# EAGLE design capbot (EAGLE 7.5.0)
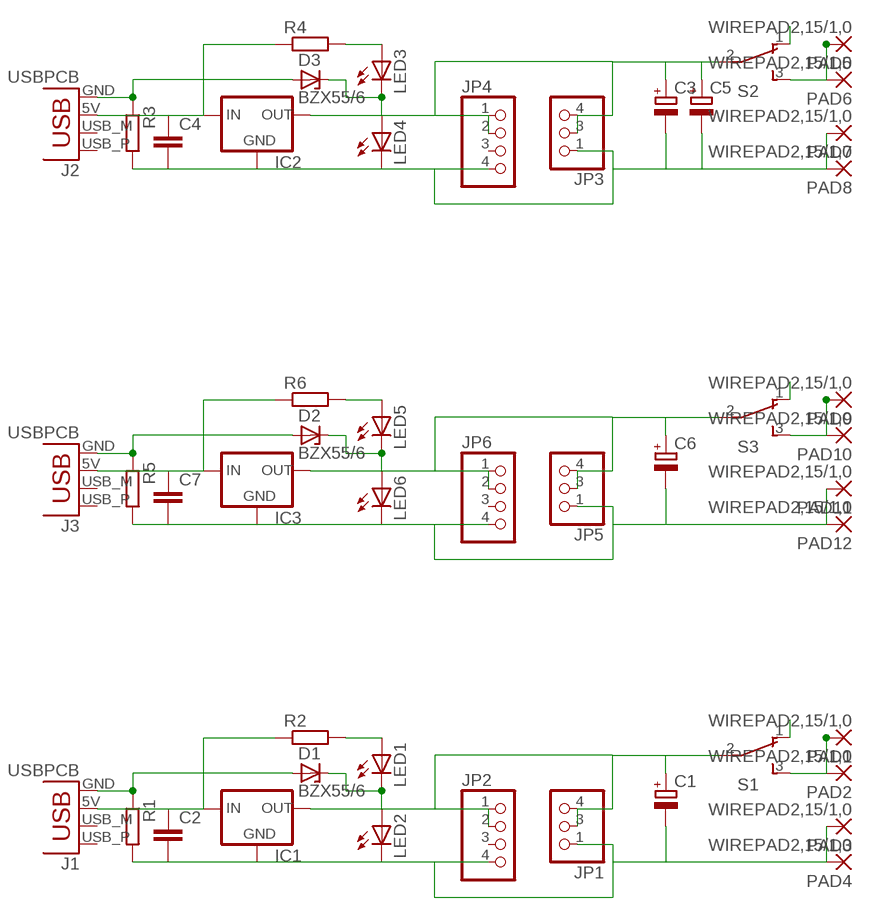
[diagram p0: schematic, sheet 1]

## Parts
C1  CPOL-EUE5-10.5  [E5-10,5]
C2  C-EUC1206  [C1206]
C3  CPOL-EUE5-10.5  [E5-10,5]
C4  C-EUC1206  [C1206]
C5  CPOL-EUE5-10.5  [E5-10,5]
C6  CPOL-EUE5-10.5  [E5-10,5]
C7  C-EUC1206  [C1206]
D1  BZX55/6  [DO35Z6]
D2  BZX55/6  [DO35Z6]
D3  BZX55/6  [DO35Z6]
IC1  MCP1700INLINE  [TO92-INLINE]
IC2  MCP1700INLINE  [TO92-INLINE]
IC3  MCP1700INLINE  [TO92-INLINE]
J1  USBPCB  [USB-A-PCB]
J2  USBPCB  [USB-A-PCB]
J3  USBPCB  [USB-A-PCB]
JP1  PINHD-1X3-4GAP  [1X04/GAP2]
JP2  PINHD-1X4  [1X04/OFFSETDOWN]
JP3  PINHD-1X3-4GAP  [1X04/GAP2]
JP4  PINHD-1X4  [1X04/OFFSETDOWN]
JP5  PINHD-1X3-4GAP  [1X04/GAP2]
JP6  PINHD-1X4  [1X04/OFFSETDOWN]
LED1  LED3MM-MOREFLAT  [LED3MM-MOREFLAT]
LED2  LED3MM-MOREFLAT  [LED3MM-MOREFLAT]
LED3  LED3MM-MOREFLAT  [LED3MM-MOREFLAT]
LED4  LED3MM-MOREFLAT  [LED3MM-MOREFLAT]
LED5  LED3MM-MOREFLAT  [LED3MM-MOREFLAT]
LED6  LED3MM-MOREFLAT  [LED3MM-MOREFLAT]
PAD1  WIREPAD2,15/1,0  [2,15/1,0]
PAD2  WIREPAD2,15/1,0  [2,15/1,0]
PAD3  WIREPAD2,15/1,0  [2,15/1,0]
PAD4  WIREPAD2,15/1,0  [2,15/1,0]
PAD5  WIREPAD2,15/1,0  [2,15/1,0]
PAD6  WIREPAD2,15/1,0  [2,15/1,0]
PAD7  WIREPAD2,15/1,0  [2,15/1,0]
PAD8  WIREPAD2,15/1,0  [2,15/1,0]
PAD9  WIREPAD2,15/1,0  [2,15/1,0]
PAD10  WIREPAD2,15/1,0  [2,15/1,0]
PAD11  WIREPAD2,15/1,0  [2,15/1,0]
PAD12  WIREPAD2,15/1,0  [2,15/1,0]
R1  R-EU_0207/7  [0207/7]
R2  R-EU_0207/7  [0207/7]
R3  R-EU_0207/7  [0207/7]
R4  R-EU_0207/7  [0207/7]
R5  R-EU_0207/7  [0207/7]
R6  R-EU_0207/7  [0207/7]
S1  TL36PO  [TL3XPO]
S2  TL36PO  [TL3XPO]
S3  TL36PO  [TL3XPO]

## Nets
N$1: C1.- C2.2 IC1.1(GND) JP1.1 JP2.4 LED2.K(C) PAD3.1(P) PAD4.1(P) R1.2
N$2: C1.+ IC1.3(OUT) JP1.3 JP1.4 JP2.1 JP2.2 S1.2(P)
N$3: PAD1.1(P) PAD2.1(P) S1.3(S)
N$4: D1.A J1.GND R1.1
N$6: C2.1 IC1.2(IN) J1.5V(VBUS) R2.1
N$8: LED1.A R2.2
N$9: D1.C LED1.K(C) LED2.A
N$10: S1.1(O)
N$11: C3.- C4.2 C5.- IC2.1(GND) JP3.1 JP4.4 LED4.K(C) PAD7.1(P) PAD8.1(P) R3.2
N$12: C3.+ C5.+ IC2.3(OUT) JP3.3 JP3.4 JP4.1 JP4.2 S2.2(P)
N$13: PAD5.1(P) PAD6.1(P) S2.3(S)
N$14: D3.A J2.GND R3.1
N$16: C4.1 IC2.2(IN) J2.5V(VBUS) R4.1
N$18: LED3.A R4.2
N$19: D3.C LED3.K(C) LED4.A
N$20: S2.1(O)
N$21: C6.- C7.2 IC3.1(GND) JP5.1 JP6.4 LED6.K(C) PAD11.1(P) PAD12.1(P) R5.2
N$22: C6.+ IC3.3(OUT) JP5.3 JP5.4 JP6.1 JP6.2 S3.2(P)
N$23: PAD9.1(P) PAD10.1(P) S3.3(S)
N$24: D2.A J3.GND R5.1
N$26: C7.1 IC3.2(IN) J3.5V(VBUS) R6.1
N$28: LED5.A R6.2
N$29: D2.C LED5.K(C) LED6.A
N$30: S3.1(O)
Unconnected: J1.USB_M(D-) J1.USB_P(D+) J2.USB_M(D-) J2.USB_P(D+) J3.USB_M(D-) J3.USB_P(D+) JP2.3 JP4.3 JP6.3

## Library data of the parts
C1 C3 C5 C6 = resistor:CPOL-EU: POLARIZED CAPACITOR, European symbol
C2 C4 C7 = resistor:C-EU: CAPACITOR, European symbol
D1-D3 = cwpackage:BZX55: Z DIODE
IC1-IC3 = adafruit:MCP1700: VOLTAGE REGULATOR
J1-J3 = SparkFun-Connectors:USB: USB Connectors USB-B-PTH is fully proven SKU : PRT-00139/CONN-08278 USB-miniB is fully proven SKU : PRT-00587 USB-A-PCB is untested. USB-A-H is throughly reviewed, but untested. Spark Fun Electronics SKU : PRT-00437 USB-B-SMT is throughly reviewed, but untested. Needs silkscreen touching up. USB-A-S has not been used/tested USB-MB-H has not been used/tested USB-MICROB has been used. CONN-09505
JP1 JP3 JP5 = cwpinhead:PINHD-1X3-4GAP: PIN HEADER
JP2 JP4 JP6 = cwpinhead:PINHD-1X4: PIN HEADER
LED1-LED6 = cwpackage:LED: LED OSRAM: - CHIPLED LG R971, LG N971, LY N971, LG Q971, LY Q971, LO R971, LY R971 LH N974, LH R974 LS Q976, LO Q976, LY Q976 LO Q996 - Hyper CHIPLED LW Q18S LB Q993, LB Q99A, LB R99A - SideLED LS A670, LO A670, LY A670, LG A670, LP A670 LB A673, LV A673, LT A673, LW A673 LH A674 LY A675 LS A676, LA A676, LO A676, LY A676, LW A676 LS A679, LY A679, LG A679 - Hyper Micro SIDELED® LS Y876, LA Y876, LO Y876, LY Y876 LT Y87S - SmartLED LW L88C, LW L88S LB L89C, LB L89S, LG L890 LS L89K, LO L89K, LY L89K LS L896, LA L896, LO L896, LY L896 - TOPLED LS T670, LO T670, LY T670, LG T670, LP T670 LSG T670, LSP T670, LSY T670, LOP T670, LYG T670 LG T671, LOG T671, LSG T671 LB T673, LV T673, LT T673, LW T673 LH T674 LS T676, LA T676, LO T676, LY T676, LB T676, LH T676, LSB T676, LW T676 LB T67C, LV T67C, LT T67C, LS T67K, LO T67K, LY T67K, LW E67C LS E67B, LA E67B, LO E67B, LY E67B, LB E67C, LV E67C, LT E67C LW T67C LS T679, LY T679, LG T679 LS T770, LO T770, LY T770, LG T770, LP T770 LB T773, LV T773, LT T773, LW T773 LH T774 LS E675, LA E675, LY E675, LS T675 LS T776, LA T776, LO T776, LY T776, LB T776 LHGB T686 LT T68C, LB T68C - Hyper Mini TOPLED® LB M676 - Mini TOPLED Santana® LG M470 LS M47K, LO M47K, LY M47K Source: http://www.osram.convergy.de LUXEON: - LUMILED® LXK2-PW12-R00, LXK2-PW12-S00, LXK2-PW14-U00, LXK2-PW14-V00 LXK2-PM12-R00, LXK2-PM12-S00, LXK2-PM14-U00 LXK2-PE12-Q00, LXK2-PE12-R00, LXK2-PE12-S00, LXK2-PE14-T00, LXK2-PE14-U00 LXK2-PB12-K00, LXK2-PB12-L00, LXK2-PB12-M00, LXK2-PB14-N00, LXK2-PB14-P00, LXK2-PB14-Q00 LXK2-PR12-L00, LXK2-PR12-M00, LXK2-PR14-Q00, LXK2-PR14-R00 LXK2-PD12-Q00, LXK2-PD12-R00, LXK2-PD12-S00 LXK2-PH12-R00, LXK2-PH12-S00 LXK2-PL12-P00, LXK2-PL12-Q00, LXK2-PL12-R00 Source: www.luxeon.com KINGBRIGHT: KA-3528ASYC Source: www.kingbright.com
PAD1-PAD12 = wirepad:WIREPAD: Wire PAD connect wire on PCB
R1-R6 = resistor:R-EU_: RESISTOR, European symbol
S1-S3 = switch:TL36PO: TINY SWITCH ON - ON Source: http://www2.produktinfo.conrad.com/datenblaetter/700000-724999/705152-da-01-de-Subminiaturschalter_TL_36YO.pdf

## Net classes
0 default: clearance 0.205 mm

## Board
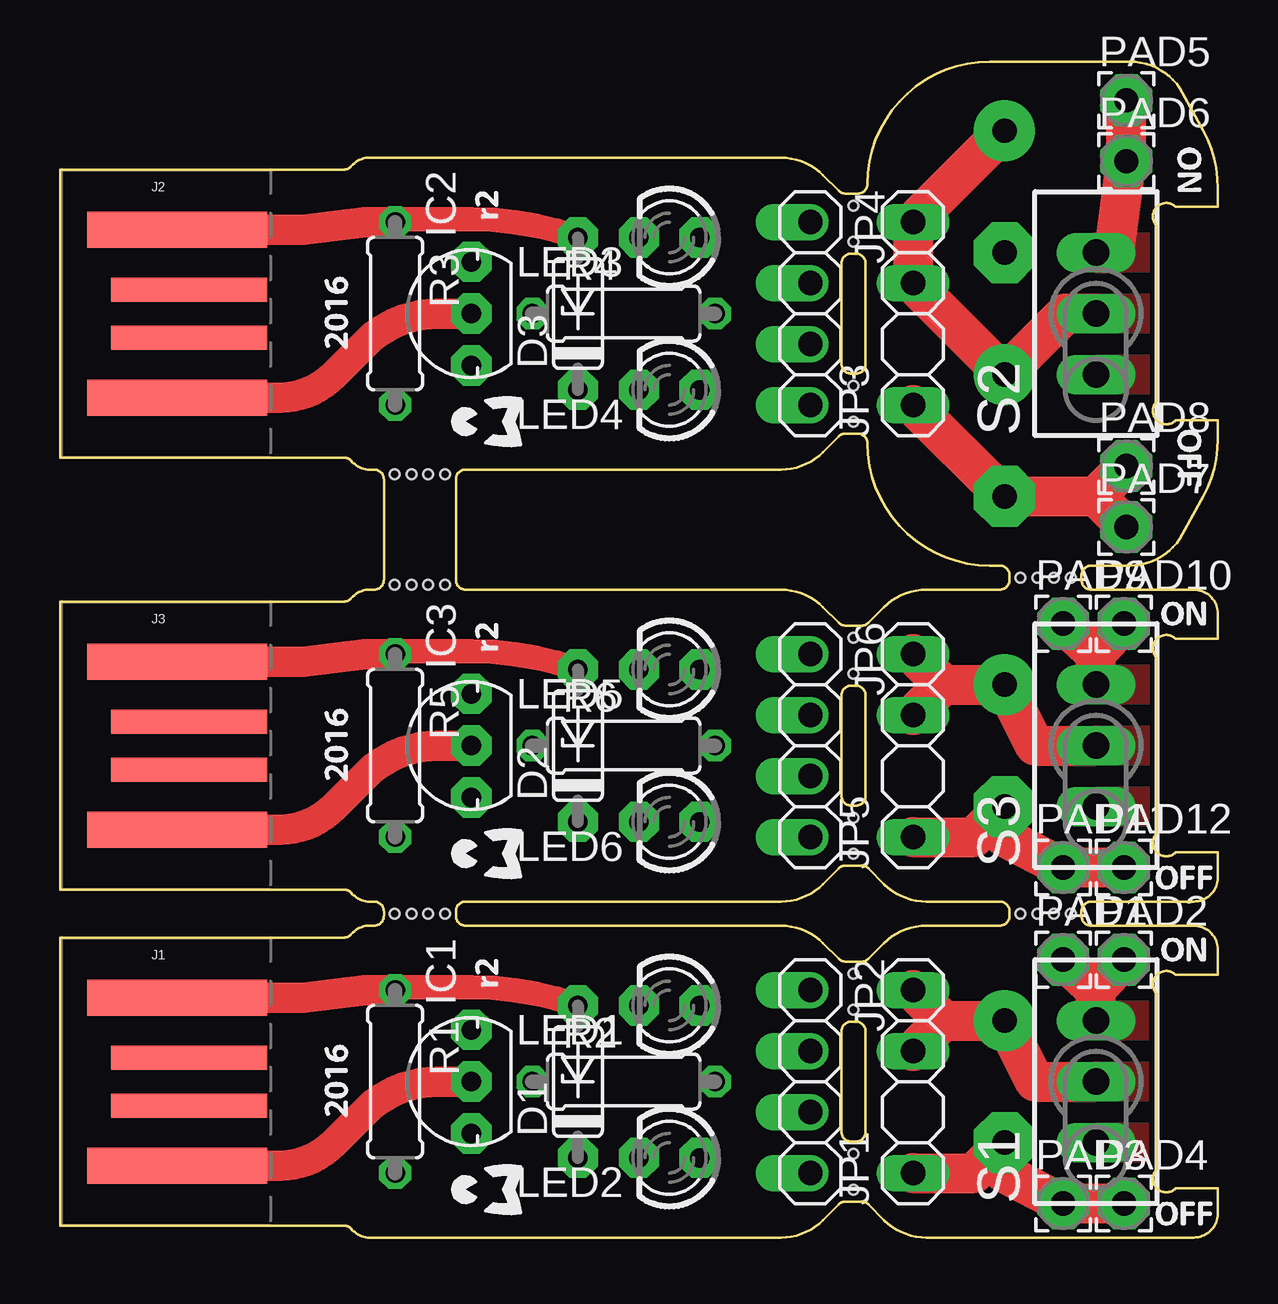
[diagram p1: board, top side]
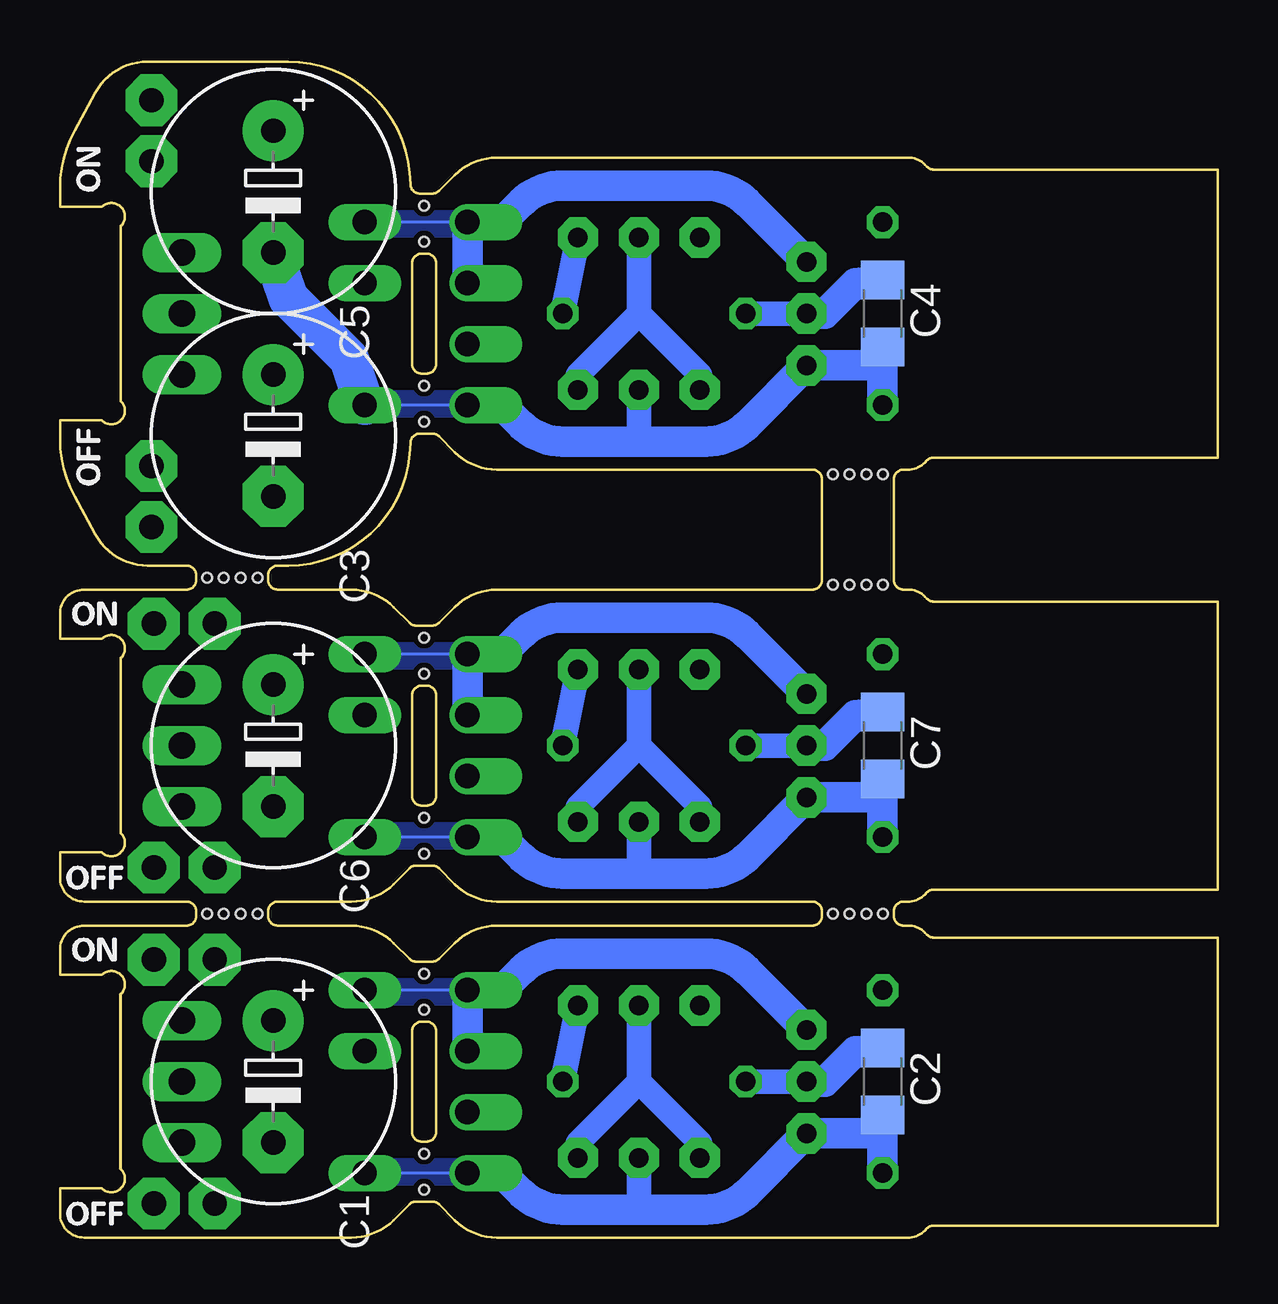
[diagram p2: board, bottom side, seen from below]

Size 48.26 x 49 mm. Coordinates in mm from the lower left corner, seen from the top.
Outline: 32.75,1.5 33.41,1.5 arc-45 33.7,1.38 34.35,0.73 arc45 36.12,0 47.26,0 arc90 48.26,1 48.26,2.06 46.51,2.06 arc-90 45.72,2.06 arc-90 45.72,2.85 45.72,10.15 arc-90 45.72,10.95 arc-90 46.51,10.95 48.26,10.95 48.26,12 arc90 47.26,13 42.98,13 arc-90 42.58,13.4 42.58,13.6 arc-90 42.98,14 47.26,14 arc90 48.26,15 48.26,16.05 46.51,16.05 arc-90 45.72,16.05 arc-90 45.72,16.85 45.72,24.15 arc-90 45.72,24.95 arc-90 46.51,24.95 48.26,24.95 48.26,26 arc90 47.26,27 42.98,27 arc-90 42.58,27.4 42.58,27.6 arc-90 42.98,28 44.59,28 arc61 46.79,29.3 47.65,30.88 arc29 48.26,33.27 48.26,34.05 46.51,34.05 arc-90 45.72,34.05 arc-90 45.72,34.85 45.72,42.15 arc-90 45.72,42.95 arc-90 46.51,42.95 48.26,42.95 48.26,43.73 arc29 47.65,46.12 46.79,47.7 arc61 44.59,49 38.76,49 arc90 33.66,43.9 arc-90 33.26,43.5 32.75,43.5 arc-45 32.46,43.62 31.81,44.27 arc45 30.04,45 12.91,45 arc45 12.21,44.71 12.12,44.62 arc-45 11.83,44.5 0,44.5 0,32.5 11.83,32.5 arc-45 12.12,32.38 12.21,32.29 arc45 12.91,32 13.1,32 arc-90 13.5,31.6 13.5,27.4 arc-90 13.1,27 12.91,27 arc45 12.21,26.71 12.12,26.62 arc-45 11.83,26.5 0,26.5 0,14.5 11.83,14.5 arc-45 12.12,14.38 12.21,14.29 arc45 12.91,14 13.1,14 arc-90 13.5,13.6 13.5,13.4 arc-90 13.1,13 12.91,13 arc45 12.21,12.71 12.12,12.62 arc-45 11.83,12.5 0,12.5 0,0.5 11.83,0.5 arc-45 12.12,0.38 12.21,0.29 arc45 12.91,0 30.04,0 arc45 31.81,0.73 32.46,1.38 arc-45 32.75,1.5
Outline: 36.12,13 39.18,13 arc90 39.58,13.4 39.58,13.6 arc90 39.18,14 36.12,14 arc-45 34.35,14.73 33.7,15.38 arc45 33.41,15.5 32.75,15.5 arc45 32.46,15.38 31.81,14.73 arc-45 30.04,14 16.9,14 arc90 16.5,13.6 16.5,13.4 arc90 16.9,13 30.04,13 arc-45 31.81,12.27 32.46,11.62 arc45 32.75,11.5 33.41,11.5 arc45 33.7,11.62 34.35,12.27 arc-45 36.12,13
Outline: 33.66,33.1 arc90 38.76,28 39.18,28 arc-90 39.58,27.6 39.58,27.4 arc-90 39.18,27 36.12,27 arc45 34.35,26.27 33.7,25.62 arc-45 33.41,25.5 32.75,25.5 arc-45 32.46,25.62 31.81,26.27 arc45 30.04,27 16.9,27 arc-90 16.5,27.4 16.5,31.6 arc-90 16.9,32 30.04,32 arc45 31.81,32.73 32.46,33.38 arc-45 32.75,33.5 33.26,33.5 arc-90 33.66,33.1
Outline: 33.18,36 32.98,36 arc-90 32.58,36.4 32.58,40.6 arc-90 32.98,41 33.18,41 arc-90 33.58,40.6 33.58,36.4 arc-90 33.18,36
Outline: 33.18,18 32.98,18 arc-90 32.58,18.4 32.58,22.6 arc-90 32.98,23 33.18,23 arc-90 33.58,22.6 33.58,18.4 arc-90 33.18,18
Outline: 33.18,4 32.98,4 arc-90 32.58,4.4 32.58,8.6 arc-90 32.98,9 33.18,9 arc-90 33.58,8.6 33.58,4.4 arc-90 33.18,4
Copper layers (1*16): Top 0.035mm / dielectric 1.5mm / Bottom 0.035mm
Design rules "dirt_cheap_dirty_boards.v1": minimum track width 5mil, minimum drill 12mil, track to track 5mil, track to pad 5mil, pad to pad 5mil, via to via 5mil, smd to smd 0mil, copper to edge 10mil, drill to drill 10mil, minimum pad ring 10mil, minimum via ring 6mil, stop-mask expansion 2mil, vias tented up to drill 25mil, thermal gap 10mil
Holes 0.4 mm at 33.08,43 33.08,41.5 13.95,31.8 14.65,31.8 15.35,31.8 16.05,31.8 33.08,35.5 33.08,34 33.08,25 33.08,23.5 33.08,17.5 33.08,16 33.08,11 33.08,9.5 33.08,3.5 33.08,2 40.03,27.5 40.73,27.5 41.43,27.5 42.13,27.5 40.03,13.5 40.73,13.5 41.43,13.5 42.13,13.5 13.95,13.5 14.65,13.5 15.35,13.5 16.05,13.5 13.95,27.2 14.65,27.2 15.35,27.2 16.05,27.2

### Footprints (pad centres in the part's own frame; a part is rotated, then mirrored left to right if it is on the bottom)
E5-10,5 = drill 1.016 pad 2.54: + -2.54,0 | drill 1.016 pad 2.54 octagon: - 2.54,0
C1206 = smd 1.6 x 1.8: 1 -1.4,0; 2 1.4,0
DO35Z6 = drill 0.813 pad 1.676 octagon: A 3.175,0; C -3.175,0
TO92-INLINE = drill 0.813 pad 1.676 octagon: 1 -2.159,0; 2 0,0; 3 2.159,0
USB-A-PCB = smd 7.5 x 1.5: 5V -0.2,-3.5; GND -0.2,3.5 | smd 6.5 x 1: USB_M 0.3,-1; USB_P 0.3,1
1X04/GAP2 = drill 1.016 long: 1 -3.81,0; 3 1.27,0; 4 3.81,0
1X04/OFFSETDOWN = drill 1.016 offset: 1 -3.81,0; 2 -1.27,0; 3 1.27,0; 4 3.81,0
LED3MM-MOREFLAT = drill 0.813 pad 1.676 octagon: A -1.27,0; K 1.27,0
2,15/1,0 = drill 1.016 pad 2.159 octagon: 1 0,0
0207/7 = drill 0.813 octagon: 1 -3.81,0; 2 3.81,0
TL3XPO = drill 1.1 pad 1.422 long: 1 -2.54,0; 2 0,0; 3 2.54,0

### Placement (x,y rotation side)
C1  39.37,6.5 270 bottom
C2  13.97,6.5 270 bottom
C3  39.37,33.42 270 bottom
C4  13.97,38.5 270 bottom
C5  39.37,43.58 270 bottom
C6  39.37,20.5 270 bottom
C7  13.97,20.5 270 bottom
D1  21.59,6.5 90 top
D2  21.59,20.5 90 top
D3  21.59,38.5 90 top
IC1  17.14,6.5 90 top
IC2  17.14,38.5 90 top
IC3  17.14,20.5 90 top
J1  5.08,6.5 0 top
J2  5.08,38.5 0 top
J3  5.08,20.5 0 top
JP1  35.56,6.5 90 top
JP2  31.28,6.5 270 top
JP3  35.56,38.5 90 top
JP4  31.28,38.5 270 top
JP5  35.56,20.5 90 top
JP6  31.28,20.5 270 top
LED1  25.4,9.68 180 top
LED2  25.4,3.33 180 top
LED3  25.4,41.67 180 top
LED4  25.4,35.33 180 top
LED5  25.4,23.68 180 top
LED6  25.4,17.32 180 top
PAD1  41.81,11.58 0 top
PAD2  44.35,11.58 0 top
PAD3  41.81,1.42 0 top
PAD4  44.35,1.42 0 top
PAD5  44.45,47.39 0 top
PAD6  44.45,44.85 0 top
PAD7  44.45,29.61 0 top
PAD8  44.45,32.15 0 top
PAD9  41.81,25.58 0 top
PAD10  44.35,25.58 0 top
PAD11  41.81,15.42 0 top
PAD12  44.35,15.42 0 top
R1  13.97,6.5 270 top
R2  23.5,6.5 0 top
R3  13.97,38.5 270 top
R4  23.5,38.5 0 top
R5  13.97,20.5 270 top
R6  23.5,20.5 0 top
S1  43.18,6.5 90 top
S2  43.18,38.5 90 top
S3  43.18,20.5 90 top
U$1  [CWLOGO-3]  17.78,34 90 top
U$2  [CWLOGO-3]  17.78,2 90 top
U$3  [2016]  12,6.5 90 top
U$5  [2016]  12,38.5 90 top
U$7  [OFF]  46.83,14.5 0 top
U$8  [CWLOGO-3]  17.78,16 90 top
U$9  [2016]  12,20.5 90 top
U$11  [ON]  46.83,25.5 0 top
U$12  [OFF]  46.83,0.5 0 top
U$13  [ON]  46.83,11.5 0 top
U$14  [OFF]  46.83,14.5 0 bottom
U$15  [ON]  46.83,25.5 0 bottom
U$16  [OFF]  46.83,0.5 0 bottom
U$17  [ON]  46.83,11.5 0 bottom
U$18  [OFF]  46.58,32.5 270 top
U$19  [ON]  46.58,44.5 270 top
U$20  [OFF]  46.58,32.5 90 bottom
U$21  [ON]  46.58,44.5 90 bottom
U$22  [R2]  18.27,11 90 top
U$23  [R2]  18.27,25 90 top
U$24  [R2]  18.27,43 90 top

### Tracks (layer width: path | path; a pad name or v marks a point on that pad's centre or on a via)
N$1
  Top 1.676: JP1.1 38.1,2.69 C1.- 39.37,2.69 PAD3.1 PAD4.1
  Bottom 0.127: JP2.4 JP1.1
  Bottom 1.016: LED2.K 24.13,1.17
  Bottom 1.27: R1.2 C2.2 13.97,4.34 IC1.1 19.59,1.9 arc45 21.36,1.17 24.13,1.17 27.29,1.17 arc45 29.05,1.9 29.84,2.69 JP2.4
  pour Bottom (no thermals): 30.58,3.25 35.58,3.25 35.58,2.25 30.58,2.25
N$2
  Top 1.676: JP1.4 36.83,9.04 | 36.83,9.04 C1.+ 40.64,6.5 S1.2 | JP1.3 36.83,9.04
  Bottom 0.127: JP2.1 JP1.4
  Bottom 1.27: JP2.2 JP2.1 29.84,10.31 29.05,11.1 arc45 27.29,11.83 21.36,11.83 arc45 19.59,11.1 IC1.3
  pour Top (no thermals): 43.18,7.26 43.18,5.74 45.72,5.74 45.72,7.26
  pour Bottom (no thermals): 30.58,10.75 35.58,10.75 35.58,9.75 30.58,9.75
N$3
  Top 1.676: S1.3 43.18,10.31 | 43.18,10.31 PAD1.1 | PAD2.1 43.18,10.31
  pour Top (no thermals): 43.18,9.8 43.18,8.28 45.72,8.28 45.72,9.8
N$4
  Top 1.016: D1.A arc20 17.14,10.44 13.97,10.44 R1.1
  Top 1.27: J1.GND 10.16,10 12.7,10.31 R1.1
N$6
  Top 1.27: J1.5V 9.2,3 arc45 11.43,3.96 12.7,5.23 arc-45 15.75,6.5 IC1.2
  Bottom 1.016: IC1.2 R2.1
  Bottom 1.27: 14.73,7.77 C2.1 14.1,7.77 15.11,7.77 16.38,6.5 IC1.2
N$8
  Bottom 1.016: R2.2 LED1.A
N$9
  Bottom 1.016: D1.C 21.59,3.96 24.13,6.5 | 24.13,6.5 26.67,3.96 LED2.A | LED1.K 24.13,6.5
N$10
  pour Top (no thermals): 43.18,4.72 43.18,3.2 45.72,3.2 45.72,4.72
N$11
  Top 1.676: JP3.1 C3.- 43.18,30.88 | 43.18,30.88 PAD7.1 | 43.18,30.88 PAD8.1
  Bottom 0.127: JP4.4 JP3.1
  Bottom 1.016: LED4.K 24.13,33.17
  Bottom 1.27: R3.2 C4.2 13.97,36.34 IC2.1 19.59,33.9 arc45 21.36,33.17 24.13,33.17 27.29,33.17 arc45 29.05,33.9 29.84,34.69 JP4.4
  Bottom 1.676: JP3.1 36.2,36.59 38.73,39.13 C5.-
  pour Bottom (no thermals): 30.58,35.25 35.58,35.25 35.58,34.25 30.58,34.25
N$12
  Top 1.676: C5.+ JP3.4 JP3.3 C3.+ 41.91,38.5 S2.2
  Bottom 0.127: JP4.1 JP3.4
  Bottom 1.27: JP4.2 JP4.1 29.84,42.31 29.05,43.1 arc45 27.29,43.83 21.36,43.83 arc45 19.59,43.1 IC2.3
  pour Top (no thermals): 43.18,39.26 43.18,37.74 45.72,37.74 45.72,39.26
  pour Bottom (no thermals): 30.58,42.75 35.58,42.75 35.58,41.75 30.58,41.75
N$13
  Top 1.676: S2.3 43.95,41.04 PAD6.1 PAD5.1
  pour Top (no thermals): 43.18,41.8 43.18,40.28 45.72,40.28 45.72,41.8
N$14
  Top 1.016: R3.1 13.97,42.44 17.14,42.44 arc-20 D3.A
  Top 1.27: J2.GND 10.16,42 12.7,42.31 R3.1
N$16
  Top 1.27: J2.5V 9.2,35 arc45 11.43,35.96 12.7,37.23 arc-45 15.75,38.5 IC2.2
  Bottom 1.016: IC2.2 R4.1
  Bottom 1.27: C4.1 15.11,39.77 16.38,38.5 IC2.2
N$18
  Bottom 1.016: R4.2 LED3.A
N$19
  Bottom 1.016: D3.C 21.59,35.96 24.13,38.5 | 24.13,38.5 LED3.K | LED4.A 26.67,35.96 24.13,38.5
N$20
  pour Top (no thermals): 43.18,36.72 43.18,35.2 45.72,35.2 45.72,36.72
N$21
  Top 1.676: JP5.1 38.1,16.69 C6.- 39.37,16.69 PAD11.1 PAD12.1
  Bottom 0.127: JP6.4 JP5.1
  Bottom 1.016: LED6.K 24.13,15.17
  Bottom 1.27: R5.2 C7.2 13.97,18.34 IC3.1 19.59,15.9 arc45 21.36,15.17 24.13,15.17 27.29,15.17 arc45 29.05,15.9 29.84,16.69 JP6.4
  pour Bottom (no thermals): 30.58,17.25 35.58,17.25 35.58,16.25 30.58,16.25
N$22
  Top 1.676: JP5.4 36.83,23.04 | 36.83,23.04 C6.+ 40.64,20.5 S3.2 | JP5.3 36.83,23.04
  Bottom 0.127: JP6.1 JP5.4
  Bottom 1.27: JP6.2 JP6.1 29.84,24.31 29.05,25.1 arc45 27.29,25.83 21.36,25.83 arc45 19.59,25.1 IC3.3
  pour Top (no thermals): 43.18,21.26 43.18,19.74 45.72,19.74 45.72,21.26
  pour Bottom (no thermals): 30.58,24.75 35.58,24.75 35.58,23.75 30.58,23.75
N$23
  Top 1.676: S3.3 43.18,24.31 | 43.18,24.31 PAD9.1 | PAD10.1 43.18,24.31
  pour Top (no thermals): 43.18,23.8 43.18,22.28 45.72,22.28 45.72,23.8
N$24
  Top 1.016: D2.A arc20 17.14,24.44 13.97,24.44 R5.1
  Top 1.27: J3.GND 10.16,24 12.7,24.31 R5.1
N$26
  Top 1.27: J3.5V 9.2,17 arc45 11.43,17.96 12.7,19.23 arc-45 15.75,20.5 IC3.2
  Bottom 1.016: IC3.2 R6.1
  Bottom 1.27: C7.1 15.11,21.77 16.38,20.5 IC3.2
N$28
  Bottom 1.016: R6.2 LED5.A
N$29
  Bottom 1.016: D2.C 21.59,17.96 24.13,20.5 | 24.13,20.5 26.67,17.96 LED6.A | LED5.K 24.13,20.5
N$30
  pour Top (no thermals): 43.18,18.72 43.18,17.2 45.72,17.2 45.72,18.72